# EAGLE schematic HCTL200_3axis (EAGLE 6.6.0)
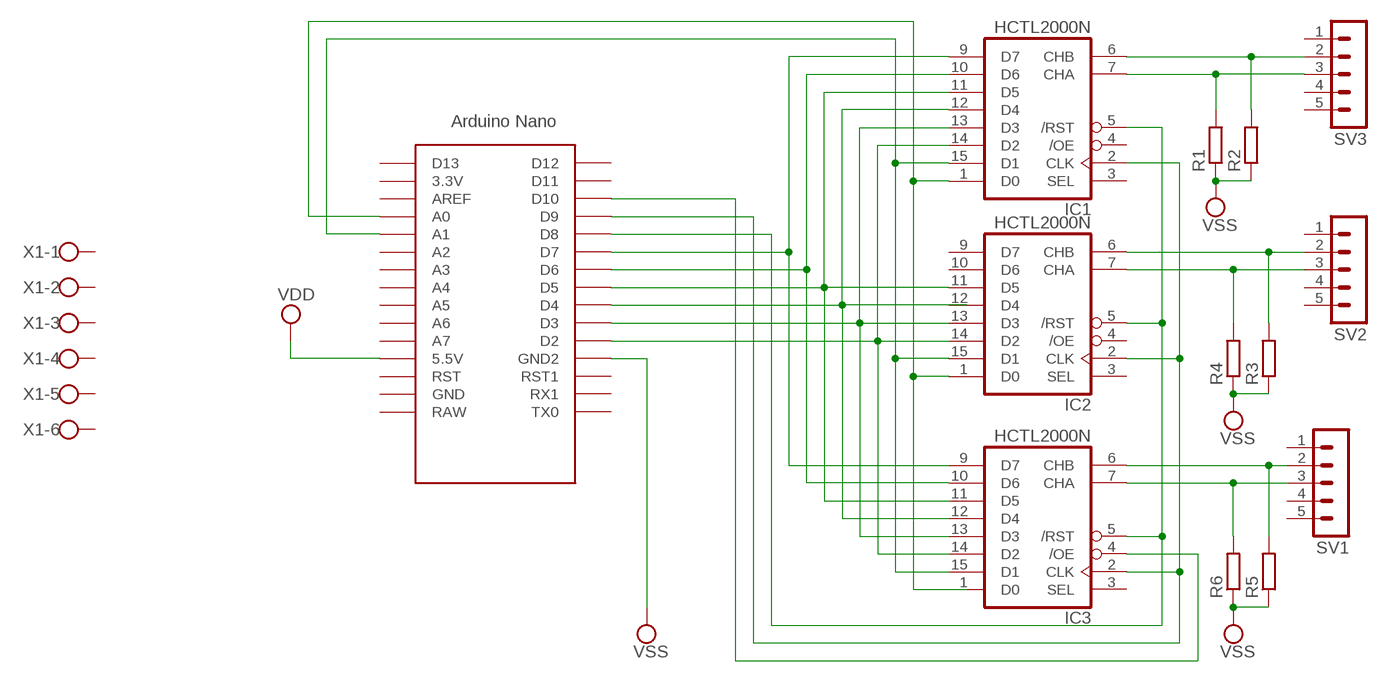
[diagram p0: schematic, sheet 1]

## Parts
IC1  HCTL2000N  [DIL16]
IC2  HCTL2000N  [DIL16]
IC3  HCTL2000N  [DIL16]
R1  R-EU_0204/7  [0204/7]
R2  R-EU_0204/7  [0204/7]
R3  R-EU_0204/7  [0204/7]
R4  R-EU_0204/7  [0204/7]
R5  R-EU_0204/7  [0204/7]
R6  R-EU_0204/7  [0204/7]
SV1  MA05-1  [MA05-1]
SV2  MA05-1  [MA05-1]
SV3  MA05-1  [MA05-1]
U$1  NANO  [NANO]
X1  W237-6  [W237-6]

## Nets
N$1: IC1.1(D0) IC2.1(D0) U$1.A0
N$2: IC1.15(D1) IC2.15(D1) IC3.15(D1) U$1.A1
N$3: IC1.14(D2) IC2.14(D2) IC3.14(D2) U$1.D2
N$4: IC1.13(D3) IC2.13(D3) IC3.13(D3) U$1.D3
N$5: IC1.12(D4) IC3.12(D4) U$1.D4
N$6: IC1.11(D5) IC2.11(D5) IC3.11(D5) U$1.D5
N$7: IC1.10(D6) IC3.10(D6) U$1.D6
N$8: IC1.9(D7) IC3.9(D7) U$1.D7
N$9: IC1.5(/RST) IC2.5(/RST) IC3.5(/RST) U$1.D8
N$10: IC1.2(CLK) IC2.2(CLK) IC3.2(CLK) U$1.D9
N$11: IC3.4(/OE) U$1.D10
N$12: IC1.6(CHB) R2.2 SV3.2
N$13: IC1.7(CHA) R1.2 SV3.3
N$14: IC2.6(CHB) R3.2 SV2.2
N$15: IC2.7(CHA) R4.2 SV2.3
N$16: IC3.6(CHB) R5.2 SV1.2
N$17: IC3.7(CHA) R6.2 SV1.3
N$18: U$1.GND1(GND2) ; supply symbol labelled VSS
VDD: U$1.5V(5.5V)
VSS: R1.1 R2.1 R3.1 R4.1 R5.1 R6.1
Unconnected: IC1.3(SEL) IC1.4(/OE) IC2.3(SEL) IC2.4(/OE) IC2.9(D7) IC2.10(D6) IC2.12(D4) IC3.1(D0) IC3.3(SEL) SV1.1 SV1.4 SV1.5 SV2.1 SV2.4 SV2.5 SV3.1 SV3.4 SV3.5 U$1.3.3V U$1.A2 U$1.A3 U$1.A4 U$1.A5 U$1.A6 U$1.A7 U$1.AREF U$1.D11 U$1.D12 U$1.D13 U$1.GND U$1.ICSP1 U$1.ICSP2 U$1.ICSP3 U$1.ICSP4 U$1.ICSP5 U$1.ICSP6 U$1.RAW U$1.RST U$1.RST1 U$1.RX1 U$1.TX0 X1.1 X1.2 X1.3 X1.4 X1.5 X1.6

## Power pins joined to a net without a drawn wire
VDD: IC1.16(VDD) IC2.16(VDD) IC3.16(VDD)
VSS: IC1.8(VSS) IC2.8(VSS) IC3.8(VSS)

## Library data of the parts
IC1-IC3 = HCTL2000:HCTL2000: 4-bit parallel in/out SHIFT REGISTER
R1-R6 = rcl:R-EU_: RESISTOR, European symbol
SV1-SV3 = con-lstb:MA05-1: PIN HEADER; OC_FARNELL: unknown; OC_NEWARK: unknown
U$1 = Arduino-clone:NANO: Arduino Nano
X1 = con-wago-500:W237-6: WAGO SCREW CLAMP; OC_FARNELL: unknown; OC_NEWARK: unknown